# EAGLE schematic Connector (EAGLE 9.3.1)
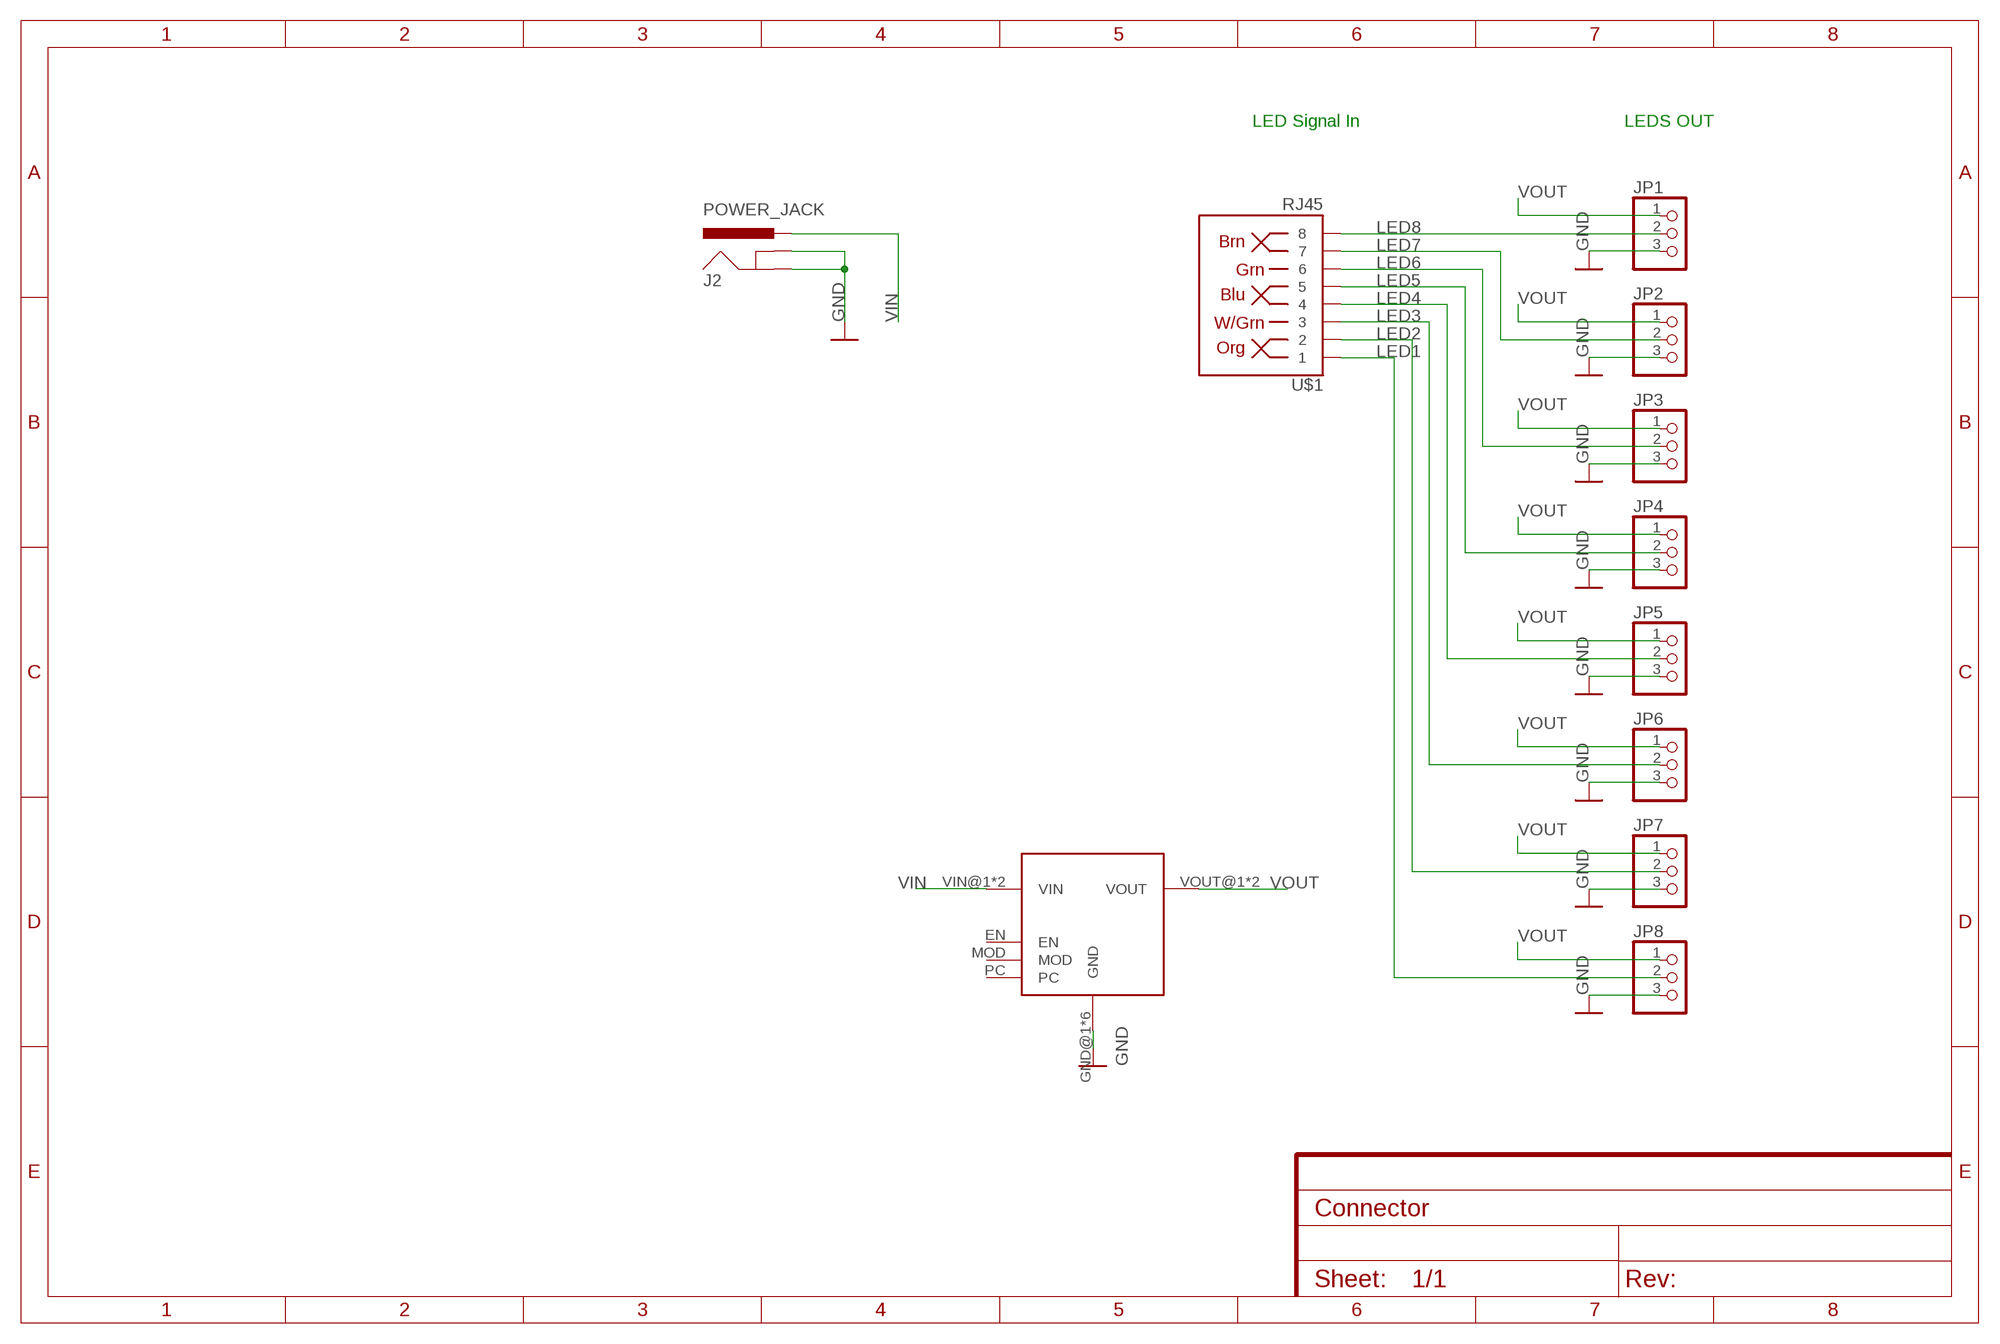
[diagram p0: schematic, sheet 1]

## Parts
J2  POWER_JACK  [POWER_JACK_PTH]
JP1  PINHD-1X3  [1X03]
JP2  PINHD-1X3  [1X03]
JP3  PINHD-1X3  [1X03]
JP4  PINHD-1X3  [1X03]
JP5  PINHD-1X3  [1X03]
JP6  PINHD-1X3  [1X03]
JP7  PINHD-1X3  [1X03]
JP8  PINHD-1X3  [1X03]
U$1  RJ45  [RJ45_WINGS]
U$2  5V-15A-VOLTAGE_CONVERTER  [D24V150F]

## Nets
GND: J2.GND J2.GNDBREAK JP1.3 JP2.3 JP3.3 JP4.3 JP5.3 JP6.3 JP7.3 JP8.3 U$2.GND@1(GND) U$2.GND@2(GND) U$2.GND@3(GND) U$2.GND@4(GND) U$2.GND@5(GND) U$2.GND@6(GND)
LED1: JP8.2 U$1.1
LED2: JP7.2 U$1.2
LED3: JP6.2 U$1.3
LED4: JP5.2 U$1.4
LED5: JP4.2 U$1.5
LED6: JP3.2 U$1.6
LED7: JP2.2 U$1.7
LED8: JP1.2 U$1.8
VIN: J2.PWR U$2.VIN@1(VIN) U$2.VIN@2(VIN)
VOUT: JP1.1 JP2.1 JP3.1 JP4.1 JP5.1 JP6.1 JP7.1 JP8.1 U$2.VOUT@1(VOUT) U$2.VOUT@2(VOUT)
Unconnected: U$2.EN U$2.MOD U$2.PC

## Notes on the sheet
- LED Signal In | LEDS OUT

## Library data of the parts
J2 = SparkFun-Connectors:POWER_JACK: Power Jack Connector This is the standard 5.5mm barrel jack for power. The PTH is the most common, proven, reliable, footprint. The Slot footprint only works if the mill layer is transmitted to the PCB fab house so be warned. Here are the connectors we sell at SparkFun: DC Barrel Power Jack/Connector <https://www.sparkfun.com/products/119> (PRT-00119) DC Barrel Power Jack/Connector (SMD) <https://www.sparkfun.com/products/12748> (PRT-12748) DC Barrel Jack Adapter - Breadboard Compatible <https://www.sparkfun.com/products/10811> (PRT-10811) It is used on this SparkFun product (and many, many others): SparkFun RedBoard - Programmed with Arduino <https://www.sparkfun.com/products/12757> (DEV-12757) Also, if you need a mating power supply or connector, please check these out: Wall Adapter Power Supply - 9VDC 650mA <https://www.sparkfun.com/products/298> (TOL-00298) DC Barrel Jack Adapter - Male <https://www.sparkfun.com/products/10287> (PRT-10287); PROD_ID: CONN-08197
JP1-JP8 = pinhead:PINHD-1X3: PIN HEADER
U$1 = myParts:RJ45: https://www.digikey.com.au/product-detail/en/assmann-wsw-components/A-2004-2-4-LP-S-R/AE10388-ND/2183639 Same as one from ali express too
U$2 = myParts:5V-15A-VOLTAGE_CONVERTER